# Altium schematic sheet Microcontroller.SchDoc
size A2; Organization: Altium Limited; Address1: L3, 12a Rodborough Rd; Address2: Frenchs Forest; Address3: NSW; Address4: Australia 2086
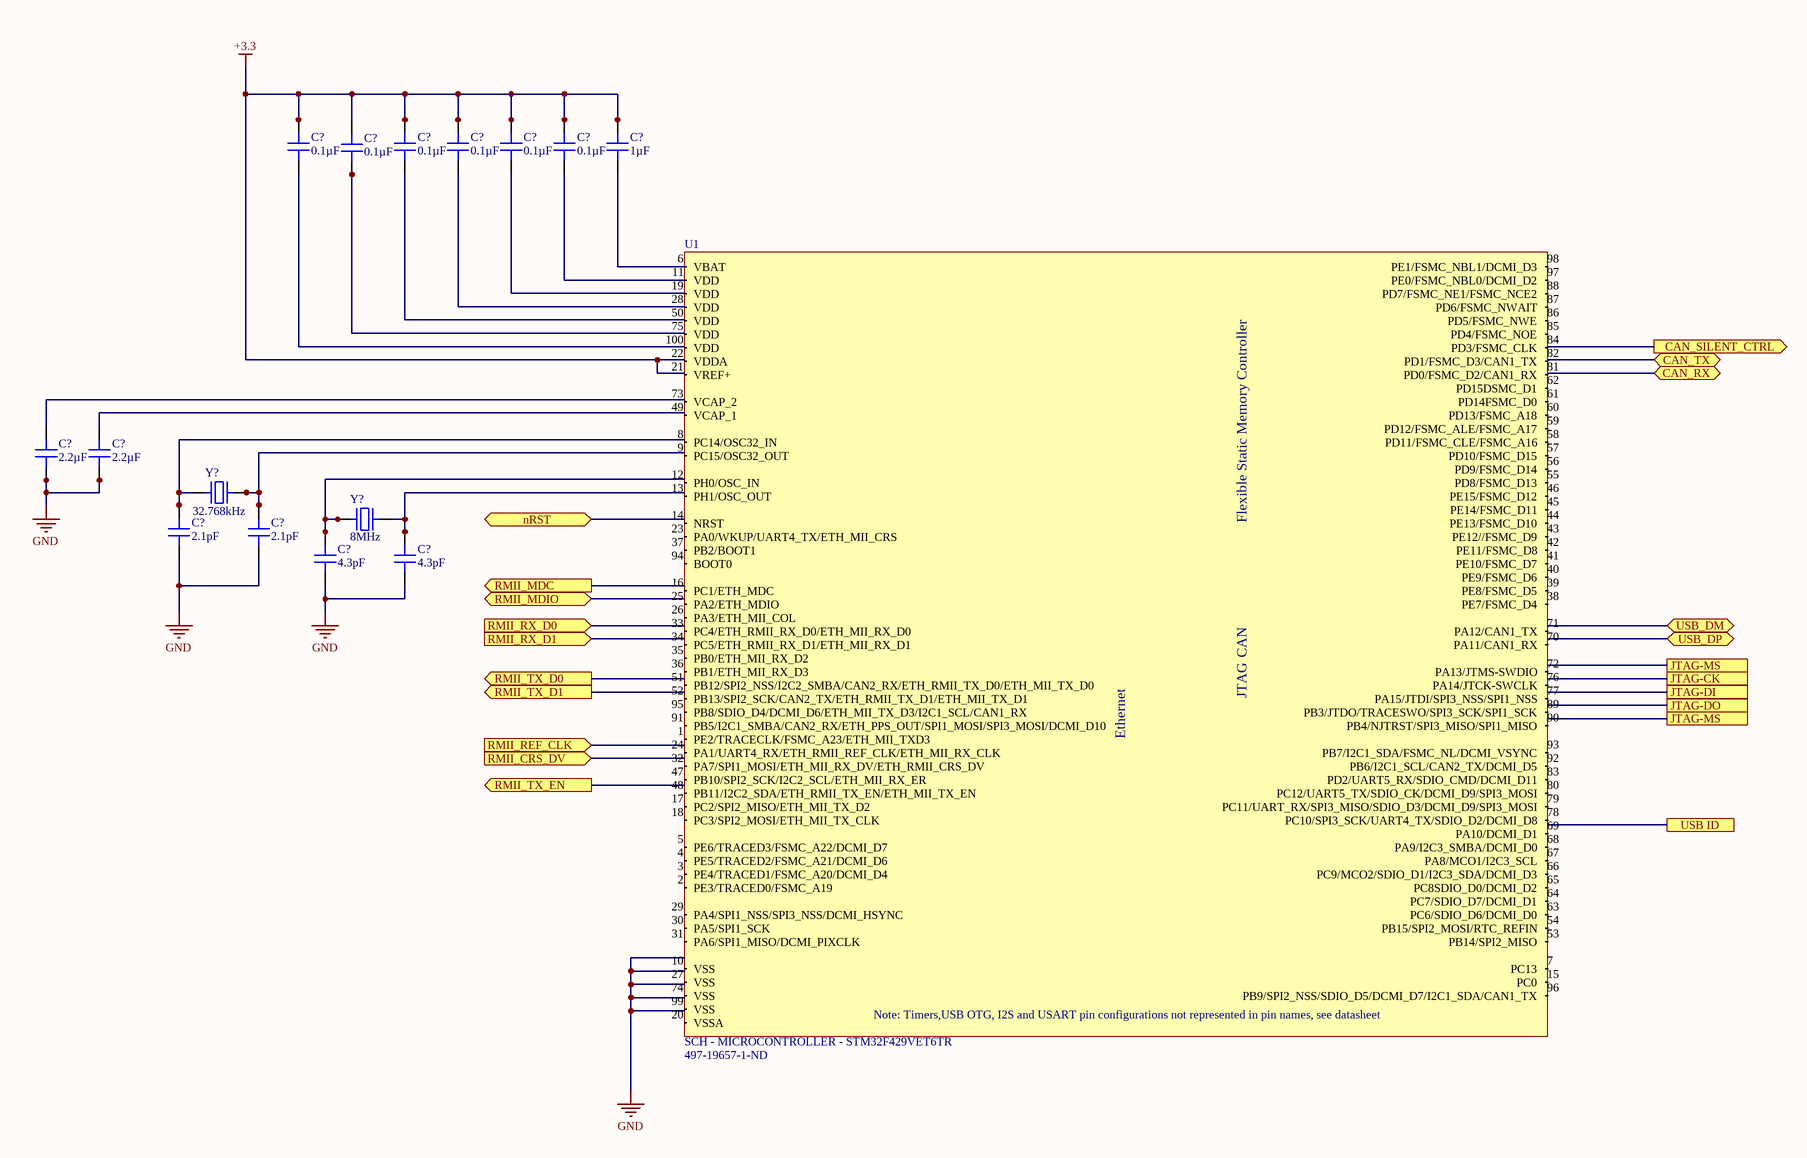
[diagram p0: Microcontroller.SchDoc]

## Parts
(Parts that share a designator on the sheet are numbered #1, #2 ... from top to bottom, then left to right.)
C?#1  0.1µF  [CAP 0603_1608]
C?#2  0.1µF  [CAP 0603_1608]
C?#3  0.1µF  [CAP 0603_1608]
C?#4  0.1µF  [CAP 0603_1608]
C?#5  0.1µF  [CAP 0603_1608]
C?#6  0.1µF  [CAP 0603_1608]
C?#7  1µF  [CAP 0603_1608]
C?#8  2.2µF  [CAP 0603_1608]
C?#9  2.2µF  [CAP 0603_1608]
C?#10  2.1pF  [CAP 0603_1608]
C?#11  2.1pF  [CAP 0603_1608]
C?#12  4.3pF  [CAP 0603_1608]
C?#13  4.3pF  [CAP 0603_1608]
U1  SCH - MICROCONTROLLER - STM32F429VET6TR  Supplier Part Number 1: 497-19657-1-ND  [PCB - LEADLESS - LQFP - ST LQFP-100 14X14MM]
Y?#1  32.768kHz  [ABRACON ABS07]
Y?#2  8MHz  [NDK NX8045GB]

## Ports
CAN_RX (bidir), CAN_SILENT_CTRL (out), CAN_TX (bidir), JTAG-CK, JTAG-DI, JTAG-DO, JTAG-MS, nRST (bidir), RMII_CRS_DV (in), RMII_MDC (out), RMII_MDIO (bidir), RMII_REF_CLK (in), RMII_RX_D0 (in), RMII_RX_D1 (in), RMII_TX_D0 (out), RMII_TX_D1 (out), RMII_TX_EN (out), USB ID, USB_DM (bidir), USB_DP (bidir)

## Nets
+3.3: C?#1.2 C?#2.2 C?#3.2 C?#4.2 C?#5.2 C?#6.2 C?#7.2
GND: C?#8.1 C?#9.1 C?#10.1 C?#11.1 C?#12.1 C?#13.1
NetC?#5_1: C?#5.1 U1.19(VDD)
NetC?#6_1: C?#6.1 U1.11(VDD)
NetC?#7_1: C?#7.1 U1.6(VBAT)
NetC?#10_2: C?#10.2 Y?#1.1
NetC?#11_2: C?#11.2 Y?#1.2
NetC?#12_2: C?#12.2 Y?#2.1
NetC?#13_2: C?#13.2 Y?#2.2

Not connected (* = marked no-connect by the designer): C?#1 1; C?#2 1; C?#3 1; C?#4 1; C?#8 2; C?#9 2; U1 1(PE2/TRACECLK/FSMC_A23/ETH_MII_TXD3) 2(PE3/TRACED0/FSMC_A19) 3(PE4/TRACED1/FSMC_A20/DCMI_D4) 4(PE5/TRACED2/FSMC_A21/DCMI_D6) 5(PE6/TRACED3/FSMC_A22/DCMI_D7) 7(PC13) 8(PC14/OSC32_IN) 9(PC15/OSC32_OUT) 10(VSS) 12(PH0/OSC_IN) 13(PH1/OSC_OUT) 14(NRST) 15(PC0) 16(PC1/ETH_MDC) 17(PC2/SPI2_MISO/ETH_MII_TX_D2) 18(PC3/SPI2_MOSI/ETH_MII_TX_CLK) 20(VSSA) 21(VREF+) 22(VDDA) 23(PA0/WKUP/UART4_TX/ETH_MII_CRS) 24(PA1/UART4_RX/ETH_RMII_REF_CLK/ETH_MII_RX_CLK) 25(PA2/ETH_MDIO) 26(PA3/ETH_MII_COL) 27(VSS) 28(VDD) 29(PA4/SPI1_NSS/SPI3_NSS/DCMI_HSYNC) 30(PA5/SPI1_SCK) 31(PA6/SPI1_MISO/DCMI_PIXCLK) 32(PA7/SPI1_MOSI/ETH_MII_RX_DV/ETH_RMII_CRS_DV) 33(PC4/ETH_RMII_RX_D0/ETH_MII_RX_D0) 34(PC5/ETH_RMII_RX_D1/ETH_MII_RX_D1) 35(PB0/ETH_MII_RX_D2) 36(PB1/ETH_MII_RX_D3) 37(PB2/BOOT1) 38(PE7/FSMC_D4) 39(PE8/FSMC_D5) 40(PE9/FSMC_D6) 41(PE10/FSMC_D7) 42(PE11/FSMC_D8) 43(PE12//FSMC_D9) 44(PE13/FSMC_D10) 45(PE14/FSMC_D11) 46(PE15/FSMC_D12) 47(PB10/SPI2_SCK/I2C2_SCL/ETH_MII_RX_ER) 48(PB11/I2C2_SDA/ETH_RMII_TX_EN/ETH_MII_TX_EN) 49(VCAP_1) 50(VDD) 51(PB12/SPI2_NSS/I2C2_SMBA/CAN2_RX/ETH_RMII_TX_D0/ETH_MII_TX_D0) 52(PB13/SPI2_SCK/CAN2_TX/ETH_RMII_TX_D1/ETH_MII_TX_D1) 53(PB14/SPI2_MISO) 54(PB15/SPI2_MOSI/RTC_REFIN) 55(PD8/FSMC_D13) 56(PD9/FSMC_D14) 57(PD10/FSMC_D15) 58(PD11/FSMC_CLE/FSMC_A16) 59(PD12/FSMC_ALE/FSMC_A17) 60(PD13/FSMC_A18) 61(PD14FSMC_D0) 62(PD15DSMC_D1) 63(PC6/SDIO_D6/DCMI_D0) 64(PC7/SDIO_D7/DCMI_D1) 65(PC8SDIO_D0/DCMI_D2) 66(PC9/MCO2/SDIO_D1/I2C3_SDA/DCMI_D3) 67(PA8/MCO1/I2C3_SCL) 68(PA9/I2C3_SMBA/DCMI_D0) 69(PA10/DCMI_D1) 70(PA11/CAN1_RX) 71(PA12/CAN1_TX) 72(PA13/JTMS-SWDIO) 73(VCAP_2) 74(VSS) 75(VDD) 76(PA14/JTCK-SWCLK) 77(PA15/JTDI/SPI3_NSS/SPI1_NSS) 78(PC10/SPI3_SCK/UART4_TX/SDIO_D2/DCMI_D8) 79(PC11/UART_RX/SPI3_MISO/SDIO_D3/DCMI_D9/SPI3_MOSI) 80(PC12/UART5_TX/SDIO_CK/DCMI_D9/SPI3_MOSI) 81(PD0/FSMC_D2/CAN1_RX) 82(PD1/FSMC_D3/CAN1_TX) 83(PD2/UART5_RX/SDIO_CMD/DCMI_D11) 84(PD3/FSMC_CLK) 85(PD4/FSMC_NOE) 86(PD5/FSMC_NWE) 87(PD6/FSMC_NWAIT) 88(PD7/FSMC_NE1/FSMC_NCE2) 89(PB3/JTDO/TRACESWO/SPI3_SCK/SPI1_SCK) 90(PB4/NJTRST/SPI3_MISO/SPI1_MISO) 91(PB5/I2C1_SMBA/CAN2_RX/ETH_PPS_OUT/SPI1_MOSI/SPI3_MOSI/DCMI_D10) 92(PB6/I2C1_SCL/CAN2_TX/DCMI_D5) 93(PB7/I2C1_SDA/FSMC_NL/DCMI_VSYNC) 94(BOOT0) 95(PB8/SDIO_D4/DCMI_D6/ETH_MII_TX_D3/I2C1_SCL/CAN1_RX) 96(PB9/SPI2_NSS/SDIO_D5/DCMI_D7/I2C1_SDA/CAN1_TX) 97(PE0/FSMC_NBL0/DCMI_D2) 98(PE1/FSMC_NBL1/DCMI_D3) 99(VSS) 100(VDD)

## Notes on the sheet
- Title
- Size:
- Date:
- File:
- A2
- Number:
- Time:
- Revision:
- Sheet
- of
- (in symbol SCH - MICROCONTROLLER - STM32F429VET6TR) Flexible Static Memory Controller; CAN; JTAG; Ethernet; Note: Timers,USB OTG, I2S and USART pin configurations not represented in pin names, see datasheet

## Library data of the parts
C?#1-C?#6 = VJ0603Y104KXJCW1BC: CAP CER 0.1UF 16V X7R 0603; Manufacturer: Vishay Vitramon; Tolerance: ±10%; Part Number: VJ0603Y104KXJCW1BC; Value: 0.1µF; Applications: General Purpose; Capacitance: 0.1µF; ComponentLink1Description: Datasheet; ComponentLink1URL: https://www.vishay.com/docs/28548/vjw1bcbascomseries.pdf; ComponentLink2Description: DigiKey Link; ComponentLink2URL: http://digikey.com/product-detail/en/vishay-vitramon/VJ0603Y104KXJCW1BC/720-1532-1-ND/421011; Device Package: 0603 (1608 Metric); LastUpdated: 9/2/2020 1:03:10 AM; Lifecycle Status: Active; Minimum Order: 1; Mounting Type: Surface Mount, MLCC; Operating Temperature: -55°C ~ 125°C; Package / Case: 0603 (1608 Metric); Packaging: TapeAndReel; PartId: 15347; Part Status: Active; Price: 0.03; Series: VJ; Size / Dimension: 0.063" L x 0.031" W (1.60mm x 0.80mm); Supplier 1: DigiKey; Supplier Part Number 1: 720-1532-1-ND; Temperature Coefficient: X7R; Thickness (Max): 0.035" (0.90mm); Voltage - Rated: 16V
C?#7 = GCM188R71C105KA64J: CAP CER 1UF 16V X7R 0603; Manufacturer: Murata Electronics; Tolerance: ±10%; Part Number: GCM188R71C105KA64J; Value: 1µF; Applications: Automotive; Capacitance: 1µF; ComponentLink1Description: Datasheet; ComponentLink1URL: https://www.murata.com/~/media/webrenewal/support/library/catalog/products/capacitor/mlcc/c03e.ashx?la=en-us; ComponentLink2Description: DigiKey Link; ComponentLink2URL: http://digikey.com/product-detail/en/murata-electronics/GCM188R71C105KA64J/490-12657-1-ND/5797626; Device Package: 0603 (1608 Metric); LastUpdated: 9/2/2020 1:03:14 AM; Lifecycle Status: Active; Minimum Order: 1; Mounting Type: Surface Mount, MLCC; Operating Temperature: -55°C ~ 125°C; Package / Case: 0603 (1608 Metric); Packaging: TapeAndReel; PartId: 13992; Part Status: Active; Price: 0.03; Ratings: AEC-Q200; Series: GCM; Size / Dimension: 0.063" L x 0.031" W (1.60mm x 0.80mm); Supplier 1: DigiKey; Supplier Part Number 1: 490-12657-1-ND; Temperature Coefficient: X7R; Thickness (Max): 0.035" (0.90mm); Voltage - Rated: 16V
C?#8 C?#9 = EMK107BJ225KA-T: CAP CER 2.2UF 16V X5R 0603; Manufacturer: Taiyo Yuden; Tolerance: ±10%; Part Number: EMK107BJ225KA-T; Value: 2.2µF; Applications: General Purpose; Capacitance: 2.2µF; ComponentLink1Description: Datasheet; ComponentLink1URL: https://ds.yuden.co.jp/TYCOMPAS/ut/detail?pn=EMK107BJ225KA-T  &u=M; ComponentLink2Description: DigiKey Link; ComponentLink2URL: http://digikey.com/product-detail/en/taiyo-yuden/EMK107BJ225KA-T/587-1430-1-ND/1004061; Device Package: 0603 (1608 Metric); LastUpdated: 9/2/2020 1:03:30 AM; Lifecycle Status: Active; Minimum Order: 1; Mounting Type: Surface Mount, MLCC; Operating Temperature: -55°C ~ 85°C; Package / Case: 0603 (1608 Metric); Packaging: TapeAndReel; PartId: 5619; Part Status: Active; Price: 0.02; Series: M; Size / Dimension: 0.063" L x 0.031" W (1.60mm x 0.80mm); Supplier 1: DigiKey; Supplier Part Number 1: 587-1430-1-ND; Temperature Coefficient: X5R; Thickness (Max): 0.035" (0.90mm); Voltage - Rated: 16V
C?#10 C?#11 = CBR06C219B5GAC: CAP CER RF 2.1PF 50V +/-0.1 PF C; Manufacturer: KEMET; Temperature Coefficient: C0G, NP0; Tolerance: ±0.1pF; Part Number: CBR06C219B5GAC; Value: 2.1pF; Applications: RF, Microwave, High Frequency; Capacitance: 2.1pF; ComponentLink1Description: Datasheet; ComponentLink1URL: https://api.kemet.com/component-edge/download/datasheet/CBR06C219B5GAC.pdf; ComponentLink2Description: DigiKey Link; ComponentLink2URL: http://digikey.com/product-detail/en/kemet/CBR06C219B5GAC/399-16153-1-ND/7649738; Device Package: 0603 (1608 Metric); Features: High Q, Low Loss, Ultra Low ESR; LastUpdated: 9/2/2020 1:03:15 AM; Lifecycle Status: Active; Minimum Order: 1; Mounting Type: Surface Mount, MLCC; Operating Temperature: -55°C ~ 125°C; Package / Case: 0603 (1608 Metric); Packaging: TapeAndReel; PartId: 13663; Part Status: Active; Price: 0.05; Series: CBR-SMD RF C0G; Size / Dimension: 0.063" L x 0.031" W (1.60mm x 0.80mm); Supplier 1: DigiKey; Supplier Part Number 1: 399-16153-1-ND; Thickness (Max): 0.034" (0.87mm); Voltage - Rated: 50V
C?#12 C?#13 = CBR06C439B5GAC: CAP CER RF 4.3PF 50V +/-0.1 PF C; Manufacturer: KEMET; Temperature Coefficient: C0G, NP0; Tolerance: ±0.1pF; Part Number: CBR06C439B5GAC; Value: 4.3pF; Applications: RF, Microwave, High Frequency; Capacitance: 4.3pF; ComponentLink1Description: Datasheet; ComponentLink1URL: https://api.kemet.com/component-edge/download/datasheet/CBR06C439B5GAC.pdf; ComponentLink2Description: DigiKey Link; ComponentLink2URL: http://digikey.com/product-detail/en/kemet/CBR06C439B5GAC/399-16185-1-ND/7649770; Device Package: 0603 (1608 Metric); Features: High Q, Low Loss, Ultra Low ESR; LastUpdated: 9/2/2020 1:03:25 AM; Lifecycle Status: Active; Minimum Order: 1; Mounting Type: Surface Mount, MLCC; Operating Temperature: -55°C ~ 125°C; Package / Case: 0603 (1608 Metric); Packaging: TapeAndReel; PartId: 8283; Part Status: Active; Price: 0.05; Series: CBR-SMD RF C0G; Size / Dimension: 0.063" L x 0.031" W (1.60mm x 0.80mm); Supplier 1: DigiKey; Supplier Part Number 1: 399-16185-1-ND; Thickness (Max): 0.034" (0.87mm); Voltage - Rated: 50V
Y?#1 = ABS07-166-32.768KHZ-T: IOT 32.786KHZ XTAL; Manufacturer: Abracon LLC; ESR (Equivalent Series Resistance): 70 kOhms; Frequency Tolerance: ±10ppm; Load Capacitance: 7pF; Operating Mode: Fundamental; Part Number: ABS07-166-32.768KHZ-T; ComponentLink1Description: Datasheet; ComponentLink1URL: https://abracon.com/datasheets/ABS07-166-32.768kHz-T.pdf; ComponentLink2Description: DigiKey Link; ComponentLink2URL: http://digikey.com/product-detail/en/abracon-llc/ABS07-166-32.768KHZ-T/535-14514-1-ND/8827205; Frequency: 32.768kHz; Height - Seated (Max): 0.035" (0.90mm); LastUpdated: 9/2/2020 1:21:47 AM; Lifecycle Status: Active; Minimum Order: 1; Mounting Type: Surface Mount; Operating Temperature: -40°C ~ 85°C; Package / Case: 2-SMD, No Lead; Packaging: TapeAndReel; PartId: 384; Part Status: Active; Price: 0.35; Series: ABS07; Size / Dimension: 0.126" L x 0.059" W (3.20mm x 1.50mm); Supplier 1: DigiKey; Supplier Part Number 1: 535-14514-1-ND; Type: kHz Crystal (Tuning Fork); Value: 32.768kHz
Y?#2 = NX8045GB-8.000000MHZ: CRYSTAL 8.0000MHZ 8PF SMD; Manufacturer: NDK America, Inc.; ESR (Equivalent Series Resistance): 200 Ohms; Frequency Stability: ±50ppm; Operating Mode: Fundamental; Part Number: NX8045GB-8.000000MHZ; ComponentLink1Description: Datasheet; ComponentLink1URL: //media.digikey.com/pdf/Data%20Sheets/NDK%20PDFs/NX8045GB.pdf; ComponentLink2Description: DigiKey Link; ComponentLink2URL: http://digikey.com/product-detail/en/ndk-america-inc/NX8045GB-8.000000MHZ/644-1018-1-ND/1128890; Frequency: 8MHz; Frequency Tolerance: ±50ppm; Height - Seated (Max): 0.079" (2.00mm); LastUpdated: 9/2/2020 1:22:00 AM; Lifecycle Status: Active; Load Capacitance: 8pF; Minimum Order: 1; Mounting Type: Surface Mount; Operating Temperature: -10°C ~ 70°C; Package / Case: 2-SMD, No Lead; Packaging: TapeAndReel; PartId: 653; Part Status: Active; Price: 0.30; Series: NX8045GB; Size / Dimension: 0.315" L x 0.177" W (8.00mm x 4.50mm); Supplier 1: DigiKey; Supplier Part Number 1: 644-1018-1-ND; Type: MHz Crystal; Value: 8MHz
U1 = SCH - MICROCONTROLLER - STM32F429VET6TR: Supplier 1: Digi-Key